# EAGLE design main (EAGLE 9.2.2)
TITLE: Metronome
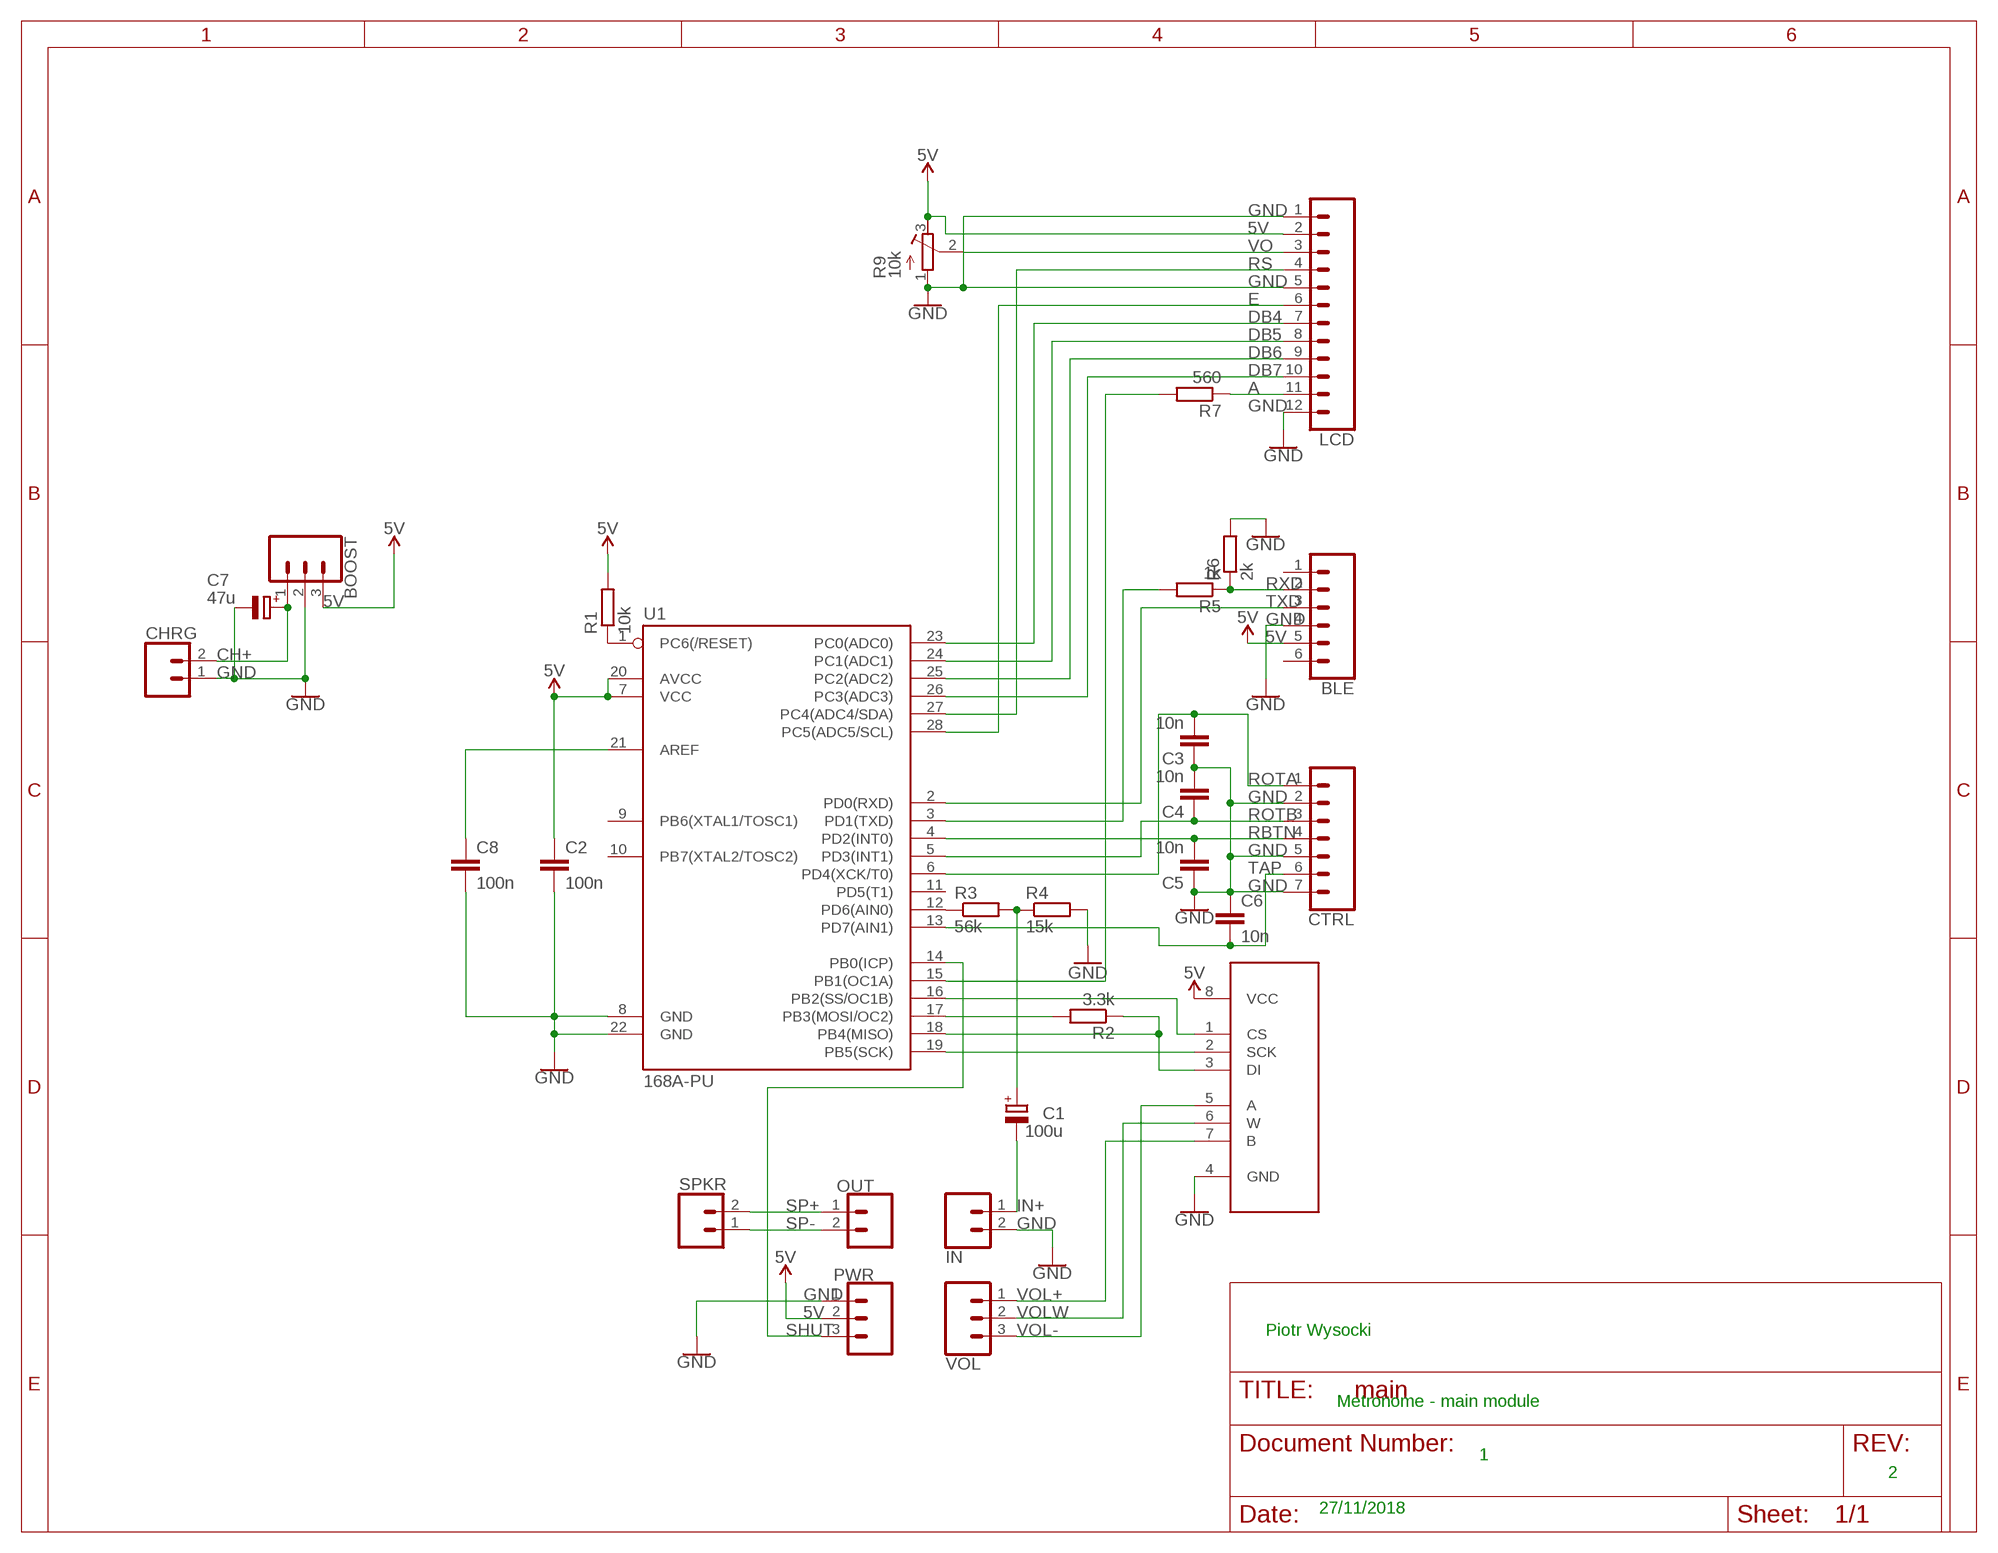
[diagram p0: schematic, sheet 1]

## Parts
BLE  CONN_06SILK_FEMALE_PTH  [1X06]
BOOST  CONN_03  [1X03]
C1  100u  CPOL-EUE3.5-8  [E3,5-8]
C2  100n  C-EU025-024X044  [C025-024X044]
C3  10n  C-EU025-024X044  [C025-024X044]
C4  10n  C-EU025-024X044  [C025-024X044]
C5  10n  C-EU025-024X044  [C025-024X044]
C6  10n  C-EU025-024X044  [C025-024X044]
C7  47u  CPOL-EUE2.5-7  [E2,5-7]
C8  100n  C-EU025-024X044  [C025-024X044]
CHRG  CONN_02  [1X02]
CTRL  CONN_07  [1X07]
IN  CONN_02  [1X02]
LCD  CONN_12  [1X12]
MCP4161  MCP41XXX  MCP41XXXDIL  [DIP08]
OUT  CONN_02  [1X02]
PWR  CONN_03  [1X03]
R1  10k  R-EU_0204/7  [0204/7]
R2  3.3k  R-EU_0204/7  [0204/7]
R3  56k  R-EU_0204/7  [0204/7]
R4  15k  R-EU_0204/7  [0204/7]
R5  1k  R-EU_0204/7  [0204/7]
R6  2k  R-EU_0204/7  [0204/7]
R7  560  R-EU_0204/7  [0204/7]
R9  10k  R-TRIMM3296W  [RTRIM3296W]
SPKR  CONN_02  [1X02]
U1  168A-PU  ATMEGA328P_PDIP  [DIP28]
VOL  CONN_03  [1X03]

## Nets
5V: BLE.5 BOOST.3 C2.1 LCD.2 MCP4161.8(VCC) PWR.2 R1.2 R9.3(E) U1.7(VCC) U1.20(AVCC)
A: LCD.11 R7.1
CH+: BOOST.1 C7.+ CHRG.2
DB4: LCD.7 U1.23(PC0(ADC0))
DB5: LCD.8 U1.24(PC1(ADC1))
DB6: LCD.9 U1.25(PC2(ADC2))
DB7: LCD.10 U1.26(PC3(ADC3))
E: LCD.6 U1.28(PC5(ADC5/SCL))
GND: BLE.4 BOOST.2 C2.2 C3.1 C4.2 C5.1 C6.1 C7.- C8.2 CHRG.1 CTRL.2 CTRL.5 CTRL.7 IN.2 LCD.1 LCD.5 LCD.12 MCP4161.4(GND) PWR.1 R4.2 R6.2 R9.1(A) U1.8(GND) U1.22(GND)
IN+: C1.- IN.1
N$1: MCP4161.2(SCK) U1.19(PB5(SCK))
N$2: MCP4161.1(CS) U1.16(PB2(SS/OC1B))
N$3: R1.1 U1.1(PC6(/RESET))
N$4: R2.2 U1.17(PB3(MOSI/OC2))
N$5: MCP4161.3(DI) R2.1 U1.18(PB4(MISO))
N$6: C8.1 U1.21(AREF)
N$12: R3.1 U1.12(PD6(AIN0))
N$14: C1.+ R3.2 R4.1
N$20: R5.2 U1.3(PD1(TXD))
N$25: R7.2 U1.15(PB1(OC1A))
RBTN: C5.2 CTRL.4 U1.4(PD2(INT0))
ROTA: C3.2 CTRL.1 U1.6(PD4(XCK/T0))
ROTB: C4.1 CTRL.3 U1.5(PD3(INT1))
RS: LCD.4 U1.27(PC4(ADC4/SDA))
RXD: BLE.2 R5.1 R6.1
SHUT: PWR.3 U1.14(PB0(ICP))
SP+: OUT.1 SPKR.2
SP-: OUT.2 SPKR.1
TAP: C6.2 CTRL.6 U1.13(PD7(AIN1))
TXD: BLE.3 U1.2(PD0(RXD))
VO: LCD.3 R9.2(S)
VOL+: MCP4161.7(B) VOL.1
VOL-: MCP4161.5(A) VOL.3
VOLW: MCP4161.6(W) VOL.2
Unconnected: BLE.1 BLE.6 U1.9(PB6(XTAL1/TOSC1)) U1.10(PB7(XTAL2/TOSC2)) U1.11(PD5(T1))

## Notes on the sheet
- Piotr Wysocki
- Metronome - main module
- 1
- 2
- 27/11/2018

## Library data of the parts
BLE = SparkFun-Connectors:CONN_06: Multi connection point. Often used as Generic Header-pin footprint for 0.1 inch spaced/style header connections On any of the 0.1 inch spaced packages, you can populate with these: Break Away Headers - Straight <https://www.sparkfun.com/products/116> (PRT-00116) Break Away Male Headers - Right Angle <https://www.sparkfun.com/products/553> (PRT-00553) Female Headers <https://www.sparkfun.com/products/115> (PRT-00115) Break Away Headers - Machine Pin <https://www.sparkfun.com/products/117> (PRT-00117) Break Away Female Headers - Swiss Machine Pin <https://www.sparkfun.com/products/743> (PRT-00743) Arduino Stackable Header - 6 Pin <https://www.sparkfun.com/products/9280> (PRT-09280) For SCREWTERMINALS and SPRING TERMINALS visit here: Screw Terimnals on SparkFun.com <https://www.sparkfun.com/search/results?term=Screw+Terminals> (5mm/3.5mm/2.54mm spacing) This device is also useful as a general connection point to wire up your design to another part of your project. Our various solder wires solder well into these plated through hole pads. Hook-Up Wire - Assortment (Stranded, 22 AWG) <https://www.sparkfun.com/products/11375> (PRT-11375) Hook-Up Wire - Assortment (Solid Core, 22 AWG) <https://www.sparkfun.com/products/11367> (PRT-11367) View the entire wire category on our website here <https://www.sparkfun.com/categories/141>; PROD_ID: CONN-08437
BOOST PWR VOL = SparkFun-Connectors:CONN_03: Multi connection point. Often used as Generic Header-pin footprint for 0.1 inch spaced/style header connections On any of the 0.1 inch spaced packages, you can populate with these: Break Away Headers - Straight <https://www.sparkfun.com/products/116> (PRT-00116) Break Away Male Headers - Right Angle <https://www.sparkfun.com/products/553> (PRT-00553) Female Headers <https://www.sparkfun.com/products/115> (PRT-00115) Break Away Headers - Machine Pin <https://www.sparkfun.com/products/117> (PRT-00117) Break Away Female Headers - Swiss Machine Pin <https://www.sparkfun.com/products/743> (PRT-00743) Stackable Header - 3 Pin (Female, 0.1") <https://www.sparkfun.com/products/13875> (PRT-13875) For SCREWTERMINALS and SPRING TERMINALS visit here: Screw Terimnals on SparkFun.com <https://www.sparkfun.com/search/results?term=Screw+Terminals> (5mm/3.5mm/2.54mm spacing) This device is also useful as a general connection point to wire up your design to another part of your project. Our various solder wires solder well into these plated through hole pads. Hook-Up Wire - Assortment (Stranded, 22 AWG) <https://www.sparkfun.com/products/11375> (PRT-11375) Hook-Up Wire - Assortment (Solid Core, 22 AWG) <https://www.sparkfun.com/products/11367> (PRT-11367) View the entire wire category on our website here <https://www.sparkfun.com/categories/141> Special notes: Molex polarized connector foot print use with SKU : PRT-08232 with associated crimp pins and housings.
C1 C7 = rcl:CPOL-EU: POLARIZED CAPACITOR, European symbol; SPICEPREFIX: C
C2-C6 C8 = rcl:C-EU: CAPACITOR, European symbol; SPICEPREFIX: C
CHRG IN OUT SPKR = SparkFun-Connectors:CONN_02: Multi connection point. Often used as Generic Header-pin footprint for 0.1 inch spaced/style header connections On any of the 0.1 inch spaced packages, you can populate with these: Break Away Headers - Straight <https://www.sparkfun.com/products/116> (PRT-00116) Break Away Male Headers - Right Angle <https://www.sparkfun.com/products/553> (PRT-00553) Female Headers <https://www.sparkfun.com/products/115> (PRT-00115) Break Away Headers - Machine Pin <https://www.sparkfun.com/products/117> (PRT-00117) Break Away Female Headers - Swiss Machine Pin <https://www.sparkfun.com/products/743> (PRT-00743) For SCREWTERMINALS and SPRING TERMINALS visit here: Screw Terimnals on SparkFun.com <https://www.sparkfun.com/search/results?term=Screw+Terminals> (5mm/3.5mm/2.54mm spacing) This device is also useful as a general connection point to wire up your design to another part of your project. Our various solder wires solder well into these plated through hole pads. Hook-Up Wire - Assortment (Stranded, 22 AWG) <https://www.sparkfun.com/products/11375> (PRT-11375) Hook-Up Wire - Assortment (Solid Core, 22 AWG) <https://www.sparkfun.com/products/11367> (PRT-11367) View the entire wire category on our website here <https://www.sparkfun.com/categories/141> Special notes: Molex polarized connector foot print use with: PRT-08233 with associated crimp pins and housings. 2.54_SCREWTERM for use with PRT-10571. 3.5mm Screw Terminal footprints for PRT-08084 5mm Screw Terminal footprints for use with PRT-08432
CTRL = SparkFun-Connectors:CONN_07: Multi connection point. Often used as Generic Header-pin footprint for 0.1 inch spaced/style header connections On any of the 0.1 inch spaced packages, you can populate with these: Break Away Headers - Straight <https://www.sparkfun.com/products/116> (PRT-00116) Break Away Male Headers - Right Angle <https://www.sparkfun.com/products/553> (PRT-00553) Female Headers <https://www.sparkfun.com/products/115> (PRT-00115) Break Away Headers - Machine Pin <https://www.sparkfun.com/products/117> (PRT-00117) Break Away Female Headers - Swiss Machine Pin <https://www.sparkfun.com/products/743> (PRT-00743) For SCREWTERMINALS and SPRING TERMINALS visit here: Screw Terimnals on SparkFun.com <https://www.sparkfun.com/search/results?term=Screw+Terminals> (5mm/3.5mm/2.54mm spacing) This device is also useful as a general connection point to wire up your design to another part of your project. Our various solder wires solder well into these plated through hole pads. Hook-Up Wire - Assortment (Stranded, 22 AWG) <https://www.sparkfun.com/products/11375> (PRT-11375) Hook-Up Wire - Assortment (Solid Core, 22 AWG) <https://www.sparkfun.com/products/11367> (PRT-11367) View the entire wire category on our website here <https://www.sparkfun.com/categories/141> Special notes: Molex polarized connector foot print use with SKU : PRT-08231 with associated crimp pins and housings. 1MM SMD Version SKU: PRT-10208 NOTES ON THE VARIANTS LOCK and LOCK_LONGPADS... This footprint was designed to help hold the alignment of a through-hole component (i.e. 6-pin header) while soldering it into place. You may notice that each hole has been shifted either up or down by 0.005 of an inch from it's more standard position (which is a perfectly straight line). This slight alteration caused the pins (the squares in the middle) to touch the edges of the holes. Because they are alternating, it causes a "brace" to hold the component in place. 0.005 has proven to be the perfect amount of "off-center" position when using our standard breakaway headers. Although looks a little odd when you look at the bare footprint, once you have a header in there, the alteration is very hard to notice. Also,if you push a header all the way into place, it is covered up entirely on the bottom side.
LCD = SparkFun-Connectors:CONN_12: Multi connection point. Often used as Generic Header-pin footprint for 0.1 inch spaced/style header connections On any of the 0.1 inch spaced packages, you can populate with these: Break Away Headers - Straight <https://www.sparkfun.com/products/116> (PRT-00116) Break Away Male Headers - Right Angle <https://www.sparkfun.com/products/553> (PRT-00553) Female Headers <https://www.sparkfun.com/products/115> (PRT-00115) Break Away Headers - Machine Pin <https://www.sparkfun.com/products/117> (PRT-00117) Break Away Female Headers - Swiss Machine Pin <https://www.sparkfun.com/products/743> (PRT-00743) For SCREWTERMINALS and SPRING TERMINALS visit here: Screw Terimnals on SparkFun.com <https://www.sparkfun.com/search/results?term=Screw+Terminals> (5mm/3.5mm/2.54mm spacing) This device is also useful as a general connection point to wire up your design to another part of your project. Our various solder wires solder well into these plated through hole pads. Hook-Up Wire - Assortment (Stranded, 22 AWG) <https://www.sparkfun.com/products/11375> (PRT-11375) Hook-Up Wire - Assortment (Solid Core, 22 AWG) <https://www.sparkfun.com/products/11367> (PRT-11367) View the entire wire category on our website here <https://www.sparkfun.com/categories/141> Special notes: Molex polarized connector foot print use with SKU : PRT-08231 with associated crimp pins and housings. 1MM SMD Version SKU: PRT-10208 NOTES ON THE VARIANTS LOCK and LOCK_LONGPADS... This footprint was designed to help hold the alignment of a through-hole component (i.e. 6-pin header) while soldering it into place. You may notice that each hole has been shifted either up or down by 0.005 of an inch from it's more standard position (which is a perfectly straight line). This slight alteration caused the pins (the squares in the middle) to touch the edges of the holes. Because they are alternating, it causes a "brace" to hold the component in place. 0.005 has proven to be the perfect amount of "off-center" position when using our standard breakaway headers. Although looks a little odd when you look at the bare footprint, once you have a header in there, the alteration is very hard to notice. Also,if you push a header all the way into place, it is covered up entirely on the bottom side.
MCP4161 = SparkFun-IC-Special-Function:MCP41XXX: Digital Potentiometer - 10K SPI controlled single digital potentiometer by Microchip Datasheet <http://cdn.sparkfun.com/datasheets/Components/General%20IC/22060b.pdf> SparkFun Products Storefront component: Digital Potentiometer - 10K <https://www.sparkfun.com/products/10613> (COM-10613); PROD_ID: RES-13155
R1-R7 = rcl:R-EU_: RESISTOR, European symbol; SPICEPREFIX: R
R9 = rcl:R-TRIMM: Trimm resistor; SPICEMODEL: X; SPICEPREFIXL: POT
U1 = SparkFun-IC-Microcontroller:ATMEGA328P_PDIP: Atmel 328P Through hole ATMEGA328P uC used in the Arduino 32kb flash, 1k EEPROM, 2k SRAM Datasheet <http://www.sparkfun.com/datasheets/Components/SMD/ATMega328.pdf> SparkFun Products Storefront component: AVR 28 Pin 20MHz 32K 6A/D - ATMega328P <https://www.sparkfun.com/products/9061> (COM-09061) SparkFun Simon Says - Through-Hole Soldering Kit <https://www.sparkfun.com/products/10547> (KIT-10547) SparkFun Learn to Solder - Simon Says <https://www.sparkfun.com/products/13708> (KIT-13708) SparkFun BigTime Watch Kit <https://www.sparkfun.com/products/11734> (KIT-11734) SparkFun ClockIt <https://www.sparkfun.com/products/10930> (KIT-10930) SparkFun Serial Enabled LCD Kit <https://www.sparkfun.com/products/10097> (LCD-10097) SparkFun Simon Tilts - Through Hole Soldering Kit <https://www.sparkfun.com/products/12634> (KIT-12634) SparkFun Frequency Counter Kit <https://www.sparkfun.com/products/10140> (KIT-10140) FabFM Radio Kit <https://www.sparkfun.com/products/11043> (KIT-11043) SparkFun Binary Blaster Kit <https://www.sparkfun.com/products/12037> (KIT-12037) SparkFun Metro-Gnome <https://www.sparkfun.com/products/9236> (KIT-09236) ATmega328 with Arduino Optiboot (Uno) <https://www.sparkfun.com/products/10524> (DEV-10524); PROD_ID: IC-09136; VALUE: 328P

## Board
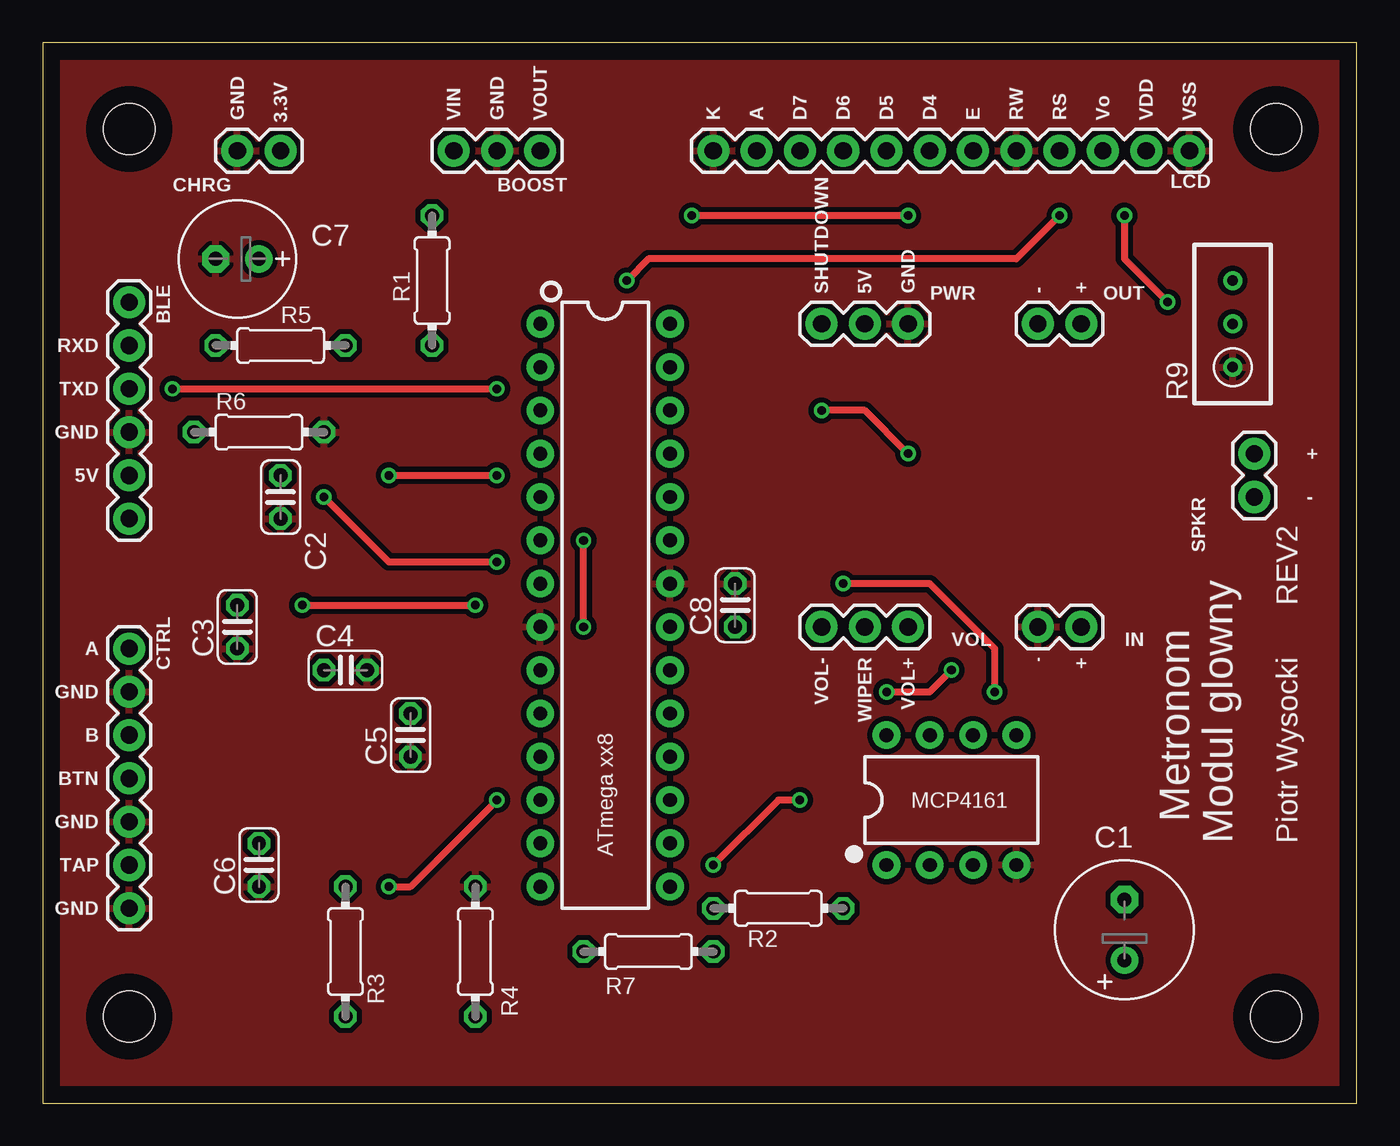
[diagram p1: board, top side]
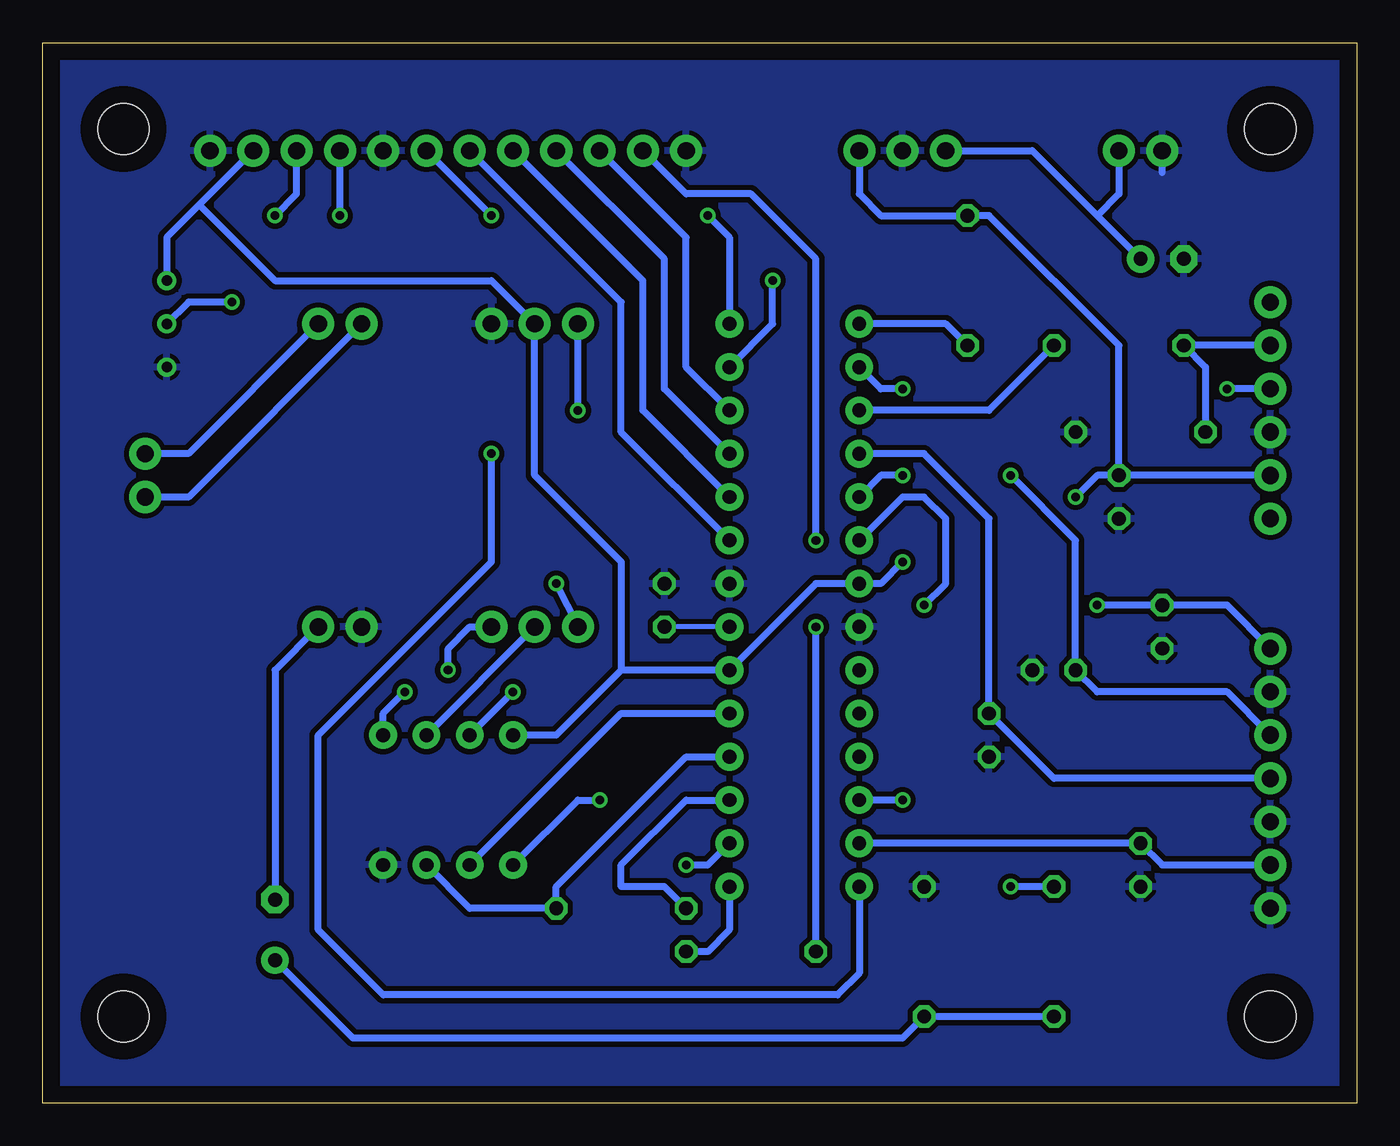
[diagram p2: board, bottom side, seen from below]

Size 77.14 x 62.22 mm. Coordinates in mm from the lower left corner, seen from the top.
Outline: 0,0 77.14,0 77.14,62.22 0,62.22 0,0
Copper layers (1*16): Top 0.035mm / dielectric 1.5mm / Bottom 0.035mm
Design rules "default": minimum track width 6mil, minimum drill 0.35mm, track to track 6mil, track to pad 6mil, pad to pad 6mil, via to via 6mil, smd to smd 6mil, copper to edge 40mil, drill to drill 6mil, minimum pad ring 10mil, minimum via ring 8mil, stop-mask expansion 4mil, vias tented up to drill 0mil, thermal gap 10mil
Holes 3 mm at 5.08,5.08 72.39,5.08 72.39,57.15 5.08,57.15

### Footprints (pad centres in the part's own frame; a part is rotated, then mirrored left to right if it is on the bottom)
1X06 = drill 1.016 pad 1.88: 1 0,0; 2 2.54,0; 3 5.08,0; 4 7.62,0; 5 10.16,0; 6 12.7,0
1X03 = drill 1.016 pad 1.88: 1 0,0; 2 2.54,0; 3 5.08,0
E3,5-8 = drill 0.813 pad 1.6: + -1.778,0 | drill 0.813 pad 1.6 octagon: - 1.778,0
C025-024X044 = drill 0.813 octagon: 1 -1.27,0; 2 1.27,0
E2,5-7 = drill 0.813 pad 1.6: + -1.27,0 | drill 0.813 pad 1.6 octagon: - 1.27,0
1X02 = drill 1.016 pad 1.88: 1 0,0; 2 2.54,0
1X07 = drill 1.016 pad 1.88: 1 0,0; 2 2.54,0; 3 5.08,0; 4 7.62,0; 5 10.16,0; 6 12.7,0; 7 15.24,0
1X12 = drill 1.016 pad 1.88: 1 0,0; 2 2.54,0; 3 5.08,0; 4 7.62,0; 5 10.16,0; 6 12.7,0; 7 15.24,0; 8 17.78,0; 9 20.32,0; 10 22.86,0; 11 25.4,0; 12 27.94,0
DIP08 = drill 0.813 pad 1.626: 1 -3.81,-3.81; 2 -1.27,-3.81; 3 1.27,-3.81; 4 3.81,-3.81; 5 3.81,3.81; 6 1.27,3.81; 7 -1.27,3.81; 8 -3.81,3.81
0204/7 = drill 0.813 octagon: 1 -3.81,0; 2 3.81,0
RTRIM3296W = drill 0.61: 1 0,-2.54; 2 0,0; 3 0,2.54
DIP28 = drill 0.813 pad 1.626: 1 -16.51,-3.81; 2 -13.97,-3.81; 3 -11.43,-3.81; 4 -8.89,-3.81; 5 -6.35,-3.81; 6 -3.81,-3.81; 7 -1.27,-3.81; 8 1.27,-3.81; 9 3.81,-3.81; 10 6.35,-3.81; 11 8.89,-3.81; 12 11.43,-3.81; 13 13.97,-3.81; 14 16.51,-3.81; 15 16.51,3.81; 16 13.97,3.81; 17 11.43,3.81; 18 8.89,3.81; 19 6.35,3.81; 20 3.81,3.81; 21 1.27,3.81; 22 -1.27,3.81; 23 -3.81,3.81; 24 -6.35,3.81; 25 -8.89,3.81; 26 -11.43,3.81; 27 -13.97,3.81; 28 -16.51,3.81

### Placement (x,y rotation side)
BLE  5.08,46.99 270 top
BOOST  24.13,55.88 0 top
C1  63.5,10.16 90 top
C2  13.97,35.56 270 top
C3  11.43,27.94 90 top
C4  17.78,25.4 0 top
C5  21.59,21.59 90 top
C6  12.7,13.97 90 top
C7  11.43,49.53 180 top
C8  40.64,29.21 90 top
CHRG  11.43,55.88 0 top
CTRL  5.08,26.67 270 top
IN  60.96,27.94 180 top
LCD  67.31,55.88 180 top
MCP4161  53.34,17.78 0 top
OUT  58.42,45.72 0 top
PWR  50.8,45.72 180 top
R1  22.86,48.26 90 top
R2  43.18,11.43 180 top
R3  17.78,8.89 270 top
R4  25.4,8.89 90 top
R5  13.97,44.45 0 top
R6  12.7,39.37 0 top
R7  35.56,8.89 0 top
R9  69.85,45.72 0 top
SPKR  71.12,38.1 270 top
U1  33.02,29.21 270 top
VOL  50.8,27.94 180 top

### Tracks (layer width: path | path; a pad name or v marks a point on that pad's centre or on a via)
5V  (via drill 0.5)
  Top 0.406: v16.51,35.56 20.32,31.75 v26.67,31.75
  Bottom 0.406: 43.18,25.4 U1.20 31.75,30.48 U1.7 27.94,30.48 v26.67,31.75 | MCP4161.8 46.99,21.59 43.18,25.4 | BLE.5 C2.1 | C2.1 15.24,36.83 v16.51,35.56 | LCD.2 67.95,52.7 | 67.95,52.7 69.85,50.8 R9.3 | 67.95,52.7 63.5,48.26 50.8,48.26 PWR.2 48.26,36.83 43.18,31.75 43.18,25.4 | C2.1 13.97,44.45 21.59,52.07 R1.2 27.94,52.07 29.21,53.34 BOOST.3
A  (via drill 0.5)
  Top 0.406: v31.75,27.94 v31.75,33.02
  Bottom 0.406: R7.1 v31.75,27.94 | LCD.11 39.37,53.34 35.56,53.34 31.75,49.53 v31.75,33.02
CH+
  Bottom 0.406: CHRG.2 13.97,53.34 15.24,52.07 | BOOST.1 19.05,55.88 15.24,52.07 | 15.24,52.07 C7.+
DB4
  Bottom 0.406: U1.23 43.18,39.37 43.18,46.99 LCD.7
DB5
  Bottom 0.406: U1.24 41.91,40.64 41.91,48.26 LCD.8
DB6
  Bottom 0.406: U1.25 40.64,41.91 40.64,49.53 LCD.9
DB7
  Bottom 0.406: U1.26 39.37,43.18 39.37,50.8 LCD.10
E  (via drill 0.5)
  Top 0.406: v50.8,52.07 v38.1,52.07
  Bottom 0.406: v38.1,52.07 36.83,50.8 U1.28 | v50.8,52.07 LCD.6
GND
  Bottom 0.406: 11.43,54.61 CHRG.1
  pour Top (isolate 0.305): 0,62.23 77.47,62.23 77.47,0 0,0
  pour Bottom (isolate 0.305): 0,62.23 0,0 77.47,0 77.47,62.23
IN+
  Bottom 0.406: IN.1 63.5,25.4 C1.-
N$1
  Bottom 0.406: MCP4161.2 43.18,22.86 U1.19
N$2  (via drill 0.5)
  Top 0.406: v44.45,17.78 43.18,17.78 v39.37,13.97
  Bottom 0.406: MCP4161.1 45.72,17.78 v44.45,17.78 | v39.37,13.97 38.1,13.97 U1.16
N$3
  Bottom 0.406: R1.1 24.13,45.72 U1.1
N$4
  Bottom 0.406: R2.2 40.64,12.7 43.18,12.7 43.18,13.97 39.37,17.78 U1.17
N$5
  Bottom 0.406: U1.18 39.37,20.32 46.99,12.7 R2.1 52.07,11.43 MCP4161.3
N$6
  Bottom 0.305: U1.21 C8.1
N$12  (via drill 0.5)
  Top 0.406: v20.32,12.7 21.59,12.7 v26.67,17.78
  Bottom 0.406: R3.1 v20.32,12.7 | v26.67,17.78 U1.12
N$14
  Bottom 0.406: R3.2 R4.1 26.67,3.81 58.93,3.81 C1.+
N$20
  Bottom 0.406: R5.2 21.59,40.64 U1.3
N$25
  Bottom 0.406: U1.15 36.83,10.16 38.1,8.89 R7.2
RBTN
  Bottom 0.406: CTRL.4 17.78,19.05 C5.2 21.59,34.29 25.4,38.1 U1.4
ROTA  (via drill 0.5)
  Top 0.406: v15.24,29.21 v25.4,29.21
  Bottom 0.406: CTRL.1 7.62,29.21 C3.2 v15.24,29.21 | v25.4,29.21 24.13,30.48 24.13,34.29 25.4,35.56 26.67,35.56 U1.6
ROTB  (via drill 0.5)
  Top 0.406: v20.32,36.83 v26.67,36.83
  Bottom 0.406: CTRL.3 7.62,24.13 15.24,24.13 C4.1 16.51,33.02 v20.32,36.83 | v26.67,36.83 27.94,36.83 U1.5
RS  (via drill 0.5)
  Top 0.406: v34.29,48.26 35.56,49.53 57.15,49.53 v59.69,52.07
  Bottom 0.406: U1.27 34.29,45.72 v34.29,48.26 | v59.69,52.07 LCD.4
RXD
  Bottom 0.406: BLE.2 R5.1 8.89,43.18 R6.1
SHUT  (via drill 0.5)
  Top 0.406: v50.8,38.1 48.26,40.64 v45.72,40.64
  Bottom 0.406: U1.14 29.21,7.62 30.48,6.35 57.15,6.35 60.96,10.16 60.96,21.59 50.8,31.75 v50.8,38.1 | v45.72,40.64 PWR.3
SP+
  Bottom 0.406: OUT.1 68.58,35.56 SPKR.2
SP-
  Bottom 0.406: OUT.2 68.58,38.1 SPKR.1
TAP
  Bottom 0.406: U1.13 C6.2 11.43,13.97 CTRL.6
TXD  (via drill 0.5)
  Top 0.406: v7.62,41.91 v26.67,41.91
  Bottom 0.406: BLE.3 v7.62,41.91 | v26.67,41.91 27.94,41.91 U1.2
VO  (via drill 0.5)
  Top 0.406: v63.5,52.07 63.5,49.53 v66.04,46.99
  Bottom 0.406: v63.5,52.07 62.23,53.34 LCD.3 | R9.2 68.58,46.99 v66.04,46.99
VOL+  (via drill 0.5)
  Top 0.406: v49.53,24.13 52.07,24.13 v53.34,25.4
  Bottom 0.406: MCP4161.7 v49.53,24.13 | v53.34,25.4 53.34,26.67 52.07,27.94 VOL.1
VOL-  (via drill 0.5)
  Top 0.406: v55.88,24.13 55.88,26.67 52.07,30.48 v46.99,30.48
  Bottom 0.406: MCP4161.5 57.15,22.86 v55.88,24.13 | v46.99,30.48 VOL.3
VOLW
  Bottom 0.406: VOL.2 MCP4161.6

### Text on the board
tPlace: REV2 | Metronom | Modul glowny | Piotr Wysocki
tNames: GND | 3.3V | VIN | GND | VOUT | K | A | D7 | D6 | D5 | D4 | E | RW | RS | Vo | VDD | VSS | SHUTDOWN | 5V | GND | - | + | RXD | TXD | GND | + | 5V | - | A | VOL- | WIPER | VOL+ | - | + | GND | B | BTN | MCP4161 | GND | TAP | ATmega xx8 | GND